# EAGLE schematic SparkFun-74HC4051-8-Channel-Mux-Breakout (EAGLE 9.6.2)
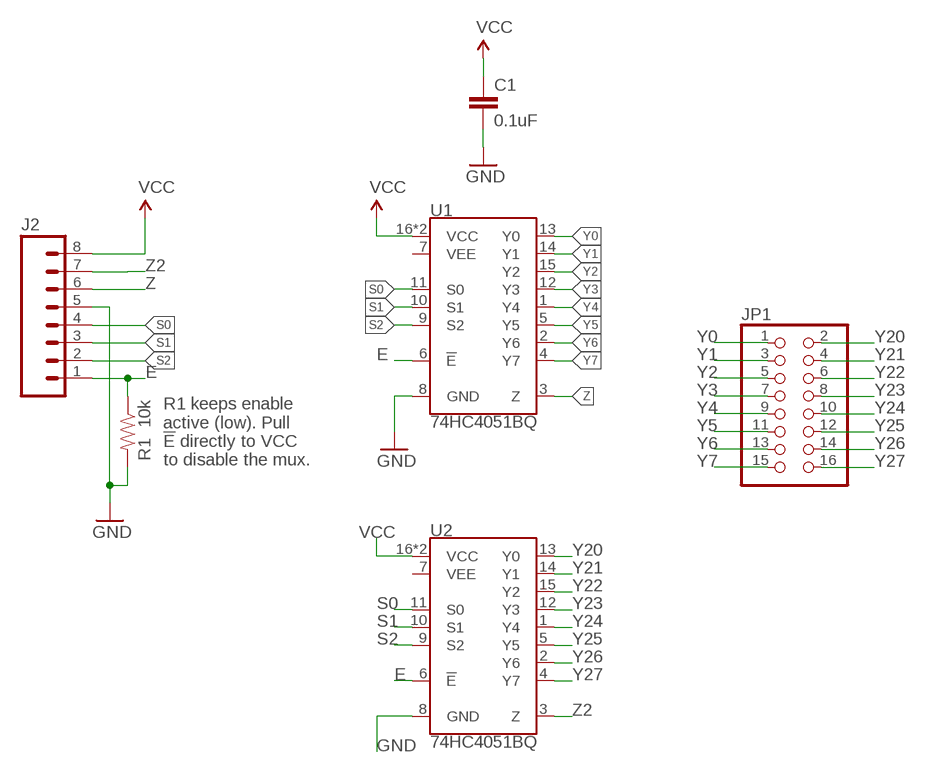
[diagram p0: schematic, sheet 1]

## Parts
C1  0.1uF  0.1UF-0603-25V-(+80/-20%)  [0603]
J2  M08  [1X08_ROUND]
JP1  PINHD-2X8  [2X08]
R1  10k  10KOHM-0603-1/10W-1%  [0603]
U1  74HC4051BQ  [DHVQFN-16-2.5X3.5MM]
U2  74HC4051BQ  [DHVQFN-16-2.5X3.5MM]

## Nets
E: J2.1 R1.1 U1.6(!E!) U2.6(!E!)
GND: C1.2 J2.5 R1.2 U1.8(GND) U2.8(GND)
S0: J2.4 U1.11(S0) U2.11(S0)
S1: J2.3 U1.10(S1) U2.10(S1)
S2: J2.2 U1.9(S2) U2.9(S2)
VCC: C1.1 J2.8 U1.16(VCC) U1.EP(VCC) U2.16(VCC) U2.EP(VCC)
Y0: JP1.1 U1.13(Y0)
Y1: JP1.3 U1.14(Y1)
Y2: JP1.5 U1.15(Y2)
Y3: JP1.7 U1.12(Y3)
Y4: JP1.9 U1.1(Y4)
Y5: JP1.11 U1.5(Y5)
Y6: JP1.13 U1.2(Y6)
Y7: JP1.15 U1.4(Y7)
Y20: JP1.2 U2.13(Y0)
Y21: JP1.4 U2.14(Y1)
Y22: JP1.6 U2.15(Y2)
Y23: JP1.8 U2.12(Y3)
Y24: JP1.10 U2.1(Y4)
Y25: JP1.12 U2.5(Y5)
Y26: JP1.14 U2.2(Y6)
Y27: JP1.16 U2.4(Y7)
Z: J2.6 U1.3(Z)
Z2: J2.7 U2.3(Z)
Unconnected: U1.7(VEE) U2.7(VEE)

## Notes on the sheet
- R1 keeps enable 
  active (low). Pull 
  !E! directly to VCC 
  to disable the mux.

## Library data of the parts
C1 = SparkFun-Capacitors:0.1UF: 0.1µF ceramic capacitors A capacitor is a passive two-terminal electrical component used to store electrical energy temporarily in an electric field.; PROD_ID: CAP-00810
J2 = SparkFun-Connectors:M08: Header 8 Standard 8-pin 0.1" header. Use with straight break away headers (SKU : PRT-00116), right angle break away headers (PRT-00553), swiss pins (PRT-00743), machine pins (PRT-00117), and female headers (PRT-00115).; PROD_ID: CONN-08437
JP1 = pinhead:PINHD-2X8: PIN HEADER
R1 = SparkFun-Resistors:10KOHM: 10kΩ resistor A resistor is a passive two-terminal electrical component that implements electrical resistance as a circuit element. Resistors act to reduce current flow, and, at the same time, act to lower voltage levels within circuits.; PROD_ID: RES-00824
U1 U2 = 8mux:74HC4051: NXP 74HC4051 8-Channel Analog Multiplexer/Demultiplexer The 74HC4051; 74HCT4051 is a single-pole octal-throw analog switch (SP8T) suitable for use in analog or digital 8:1 multiplexer/demultiplexer applications. The switch features three digital select inputs (S0, S1 and S2), eight independent inputs/outputs (Yn), a common input/output (Z) and a digital enable input (E). When E is HIGH, the switches are turned off. Inputs include clamp diodes. This enables the use of current limiting resistors to interface inputs to voltages in excess of VCC. Datasheet <http://www.nxp.com/documents/data_sheet/74HC_HCT4051.pdf>; PROD_ID: IC-13334